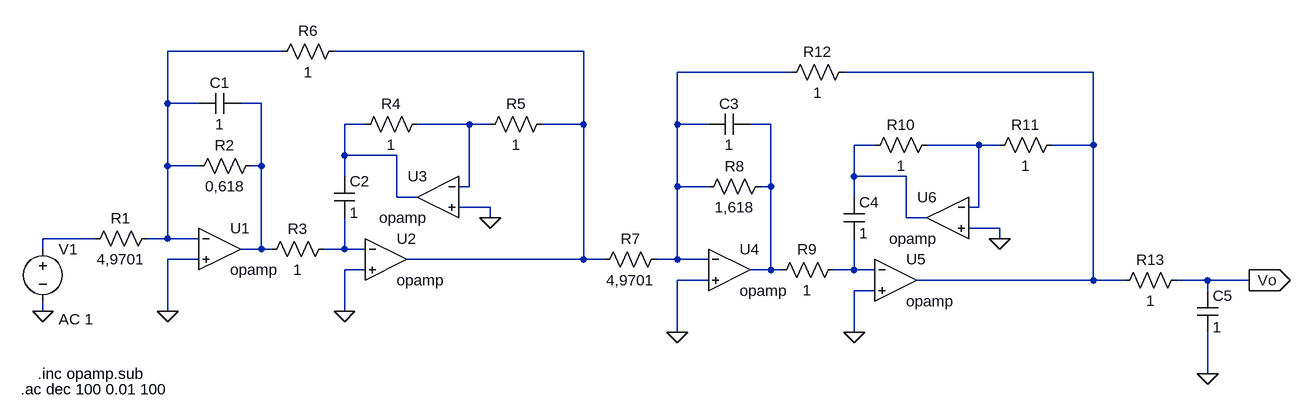
[diagram p0: schematic Draft1.asc]
Draft1.asc, the LTspice schematic file:
Version 4
SHEET 1 1644 680
WIRE 64 -192 -112 -192
WIRE 528 -192 144 -192
WIRE 848 -160 672 -160
WIRE 1312 -160 928 -160
WIRE -112 -112 -112 -192
WIRE -64 -112 -112 -112
WIRE 32 -112 0 -112
WIRE 192 -80 160 -80
WIRE 352 -80 272 -80
WIRE 384 -80 352 -80
WIRE 528 -80 528 -192
WIRE 528 -80 464 -80
WIRE 672 -80 672 -160
WIRE 720 -80 672 -80
WIRE 816 -80 784 -80
WIRE 976 -48 944 -48
WIRE 1136 -48 1056 -48
WIRE 1168 -48 1136 -48
WIRE 1312 -48 1312 -160
WIRE 1312 -48 1248 -48
WIRE 160 -32 160 -80
WIRE 240 -32 160 -32
WIRE -112 -16 -112 -112
WIRE -64 -16 -112 -16
WIRE 32 -16 32 -112
WIRE 32 -16 16 -16
WIRE 160 0 160 -32
WIRE 944 0 944 -48
WIRE 1024 0 944 0
WIRE 352 16 352 -80
WIRE 352 16 336 16
WIRE 672 16 672 -80
WIRE 720 16 672 16
WIRE 816 16 816 -80
WIRE 816 16 800 16
WIRE 240 32 240 -32
WIRE 272 32 240 32
WIRE 944 32 944 0
WIRE 384 48 336 48
WIRE 1136 48 1136 -48
WIRE 1136 48 1120 48
WIRE 384 64 384 48
WIRE 1024 64 1024 0
WIRE 1056 64 1024 64
WIRE 1168 80 1120 80
WIRE -224 96 -304 96
WIRE -112 96 -112 -16
WIRE -112 96 -144 96
WIRE -64 96 -112 96
WIRE 1168 96 1168 80
WIRE -304 112 -304 96
WIRE 32 112 32 -16
WIRE 32 112 0 112
WIRE 48 112 32 112
WIRE 160 112 160 64
WIRE 160 112 128 112
WIRE 192 112 160 112
WIRE -64 128 -112 128
WIRE 528 128 528 -80
WIRE 528 128 256 128
WIRE 560 128 528 128
WIRE 672 128 672 16
WIRE 672 128 640 128
WIRE 720 128 672 128
WIRE 192 144 160 144
WIRE 816 144 816 16
WIRE 816 144 784 144
WIRE 832 144 816 144
WIRE 944 144 944 96
WIRE 944 144 912 144
WIRE 976 144 944 144
WIRE 720 160 672 160
WIRE 1312 160 1312 -48
WIRE 1312 160 1040 160
WIRE 1360 160 1312 160
WIRE 1488 160 1440 160
WIRE 1552 160 1488 160
WIRE 976 176 944 176
WIRE 1488 176 1488 160
WIRE -304 208 -304 192
WIRE -112 208 -112 128
WIRE 160 208 160 144
WIRE 672 240 672 160
WIRE 944 240 944 176
WIRE 1488 304 1488 240
FLAG -112 208 0
FLAG 160 208 0
FLAG 384 64 0
FLAG -304 208 0
FLAG 672 240 0
FLAG 944 240 0
FLAG 1168 96 0
FLAG 1488 304 0
FLAG 1552 160 Vo
IOPIN 1552 160 Out
SYMBOL OpAmps\\opamp -32 48 R0
SYMATTR InstName U1
SYMBOL OpAmps\\opamp 224 64 R0
SYMATTR InstName U2
SYMBOL OpAmps\\opamp 304 -32 M0
SYMATTR InstName U3
SYMBOL res -128 80 R90
WINDOW 0 0 56 VBottom 2
WINDOW 3 32 56 VTop 2
SYMATTR InstName R1
SYMATTR Value 4,9701
SYMBOL res 32 -32 R90
WINDOW 0 0 56 VBottom 2
WINDOW 3 32 56 VTop 2
SYMATTR InstName R2
SYMATTR Value 0,618
SYMBOL res 144 96 R90
WINDOW 0 0 56 VBottom 2
WINDOW 3 32 56 VTop 2
SYMATTR InstName R3
SYMATTR Value 1
SYMBOL res 288 -96 R90
WINDOW 0 0 56 VBottom 2
WINDOW 3 32 56 VTop 2
SYMATTR InstName R4
SYMATTR Value 1
SYMBOL res 480 -96 R90
WINDOW 0 0 56 VBottom 2
WINDOW 3 32 56 VTop 2
SYMATTR InstName R5
SYMATTR Value 1
SYMBOL res 160 -208 R90
WINDOW 0 0 56 VBottom 2
WINDOW 3 32 56 VTop 2
SYMATTR InstName R6
SYMATTR Value 1
SYMBOL voltage -304 96 R0
WINDOW 123 24 124 Left 2
WINDOW 39 0 0 Left 0
SYMATTR InstName V1
SYMATTR Value ""
SYMATTR Value2 AC 1
SYMBOL cap 0 -128 R90
WINDOW 0 0 32 VBottom 2
WINDOW 3 32 32 VTop 2
SYMATTR InstName C1
SYMATTR Value 1
SYMBOL cap 144 0 R0
SYMATTR InstName C2
SYMATTR Value 1
SYMBOL OpAmps\\opamp 752 80 R0
SYMATTR InstName U4
SYMBOL OpAmps\\opamp 1008 96 R0
SYMATTR InstName U5
SYMBOL OpAmps\\opamp 1088 0 M0
SYMATTR InstName U6
SYMBOL res 656 112 R90
WINDOW 0 0 56 VBottom 2
WINDOW 3 32 56 VTop 2
SYMATTR InstName R7
SYMATTR Value 4,9701
SYMBOL res 816 0 R90
WINDOW 0 0 56 VBottom 2
WINDOW 3 32 56 VTop 2
SYMATTR InstName R8
SYMATTR Value 1,618
SYMBOL res 928 128 R90
WINDOW 0 0 56 VBottom 2
WINDOW 3 32 56 VTop 2
SYMATTR InstName R9
SYMATTR Value 1
SYMBOL res 1072 -64 R90
WINDOW 0 0 56 VBottom 2
WINDOW 3 32 56 VTop 2
SYMATTR InstName R10
SYMATTR Value 1
SYMBOL res 1264 -64 R90
WINDOW 0 0 56 VBottom 2
WINDOW 3 32 56 VTop 2
SYMATTR InstName R11
SYMATTR Value 1
SYMBOL res 944 -176 R90
WINDOW 0 0 56 VBottom 2
WINDOW 3 32 56 VTop 2
SYMATTR InstName R12
SYMATTR Value 1
SYMBOL cap 784 -96 R90
WINDOW 0 0 32 VBottom 2
WINDOW 3 32 32 VTop 2
SYMATTR InstName C3
SYMATTR Value 1
SYMBOL cap 928 32 R0
SYMATTR InstName C4
SYMATTR Value 1
SYMBOL res 1456 144 R90
WINDOW 0 0 56 VBottom 2
WINDOW 3 32 56 VTop 2
SYMATTR InstName R13
SYMATTR Value 1
SYMBOL cap 1472 176 R0
SYMATTR InstName C5
SYMATTR Value 1
TEXT -312 304 Left 2 !.inc opamp.sub
TEXT -338 328 Left 2 !.ac dec 100 0.01 100

The netlist it stands for:
* Draft1.asc
XU1 N001 0 N005 opamp Aol=100K GBW=10Meg  ; pins invin noninvin out
XU2 N012 0 N002 opamp Aol=100K GBW=10Meg  ; pins invin noninvin out
XU3 N007 0 N006 opamp Aol=100K GBW=10Meg  ; pins invin noninvin out
R1 N001 N011 4,9701
R2 N005 N001 0,618
R3 N012 N005 1
R4 N007 N006 1
R5 N002 N007 1
R6 N002 N001 1
V1 N011 0 AC 1
C1 N005 N001 1
C2 N006 N012 1
XU4 N003 0 N008 opamp Aol=100K GBW=10Meg  ; pins invin noninvin out
XU5 N013 0 N004 opamp Aol=100K GBW=10Meg  ; pins invin noninvin out
XU6 N010 0 N009 opamp Aol=100K GBW=10Meg  ; pins invin noninvin out
R7 N003 N002 4,9701
R8 N008 N003 1,618
R9 N013 N008 1
R10 N010 N009 1
R11 N004 N010 1
R12 N004 N003 1
C3 N008 N003 1
C4 N009 N013 1
R13 Vo N004 1
C5 Vo 0 1
.inc opamp.sub
.ac dec 100 0.01 100
.backanno
.end